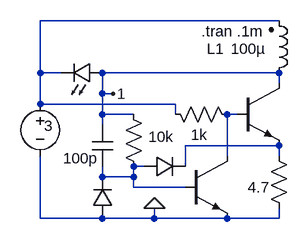
[diagram p0: schematic cur-mode-HPLED-12609.asc]
cur-mode-HPLED-12609.asc, the LTspice schematic file:
Version 4
SHEET 1 1624 1340
WIRE 304 -256 -64 -256
WIRE -64 -176 -64 -256
WIRE -32 -176 -64 -176
WIRE 304 -176 32 -176
WIRE 304 -160 304 -176
WIRE 32 -144 32 -176
WIRE 48 -144 32 -144
WIRE -64 -128 -64 -176
WIRE 144 -128 -64 -128
WIRE 32 -112 32 -144
WIRE 80 -112 32 -112
WIRE 144 -112 144 -128
WIRE 240 -112 224 -112
WIRE 32 -96 32 -112
WIRE 304 -64 160 -64
WIRE 224 -48 224 -112
WIRE 304 -48 304 -64
WIRE 96 -32 80 -32
WIRE 160 -32 160 -64
WIRE 32 -16 32 -32
WIRE 80 -16 80 -32
WIRE 80 -16 32 -16
WIRE 80 0 80 -16
WIRE 160 0 80 0
WIRE -64 48 -64 -48
WIRE 32 48 -64 48
WIRE 112 48 112 32
WIRE 112 48 32 48
WIRE 224 48 112 48
WIRE 304 48 304 32
WIRE 304 48 224 48
FLAG 112 32 0
FLAG 48 -144 1
SYMBOL ind2 288 -160 M180
WINDOW 0 -95 53 Left 0
WINDOW 3 -58 53 Left 0
SYMATTR InstName L1
SYMATTR Value 100µ
SYMBOL npn2 240 -160 R0
WINDOW 0 56 32 Invisible 0
WINDOW 3 56 68 Invisible 0
SYMATTR InstName Q7
SYMATTR Value 2N3904
SYMBOL voltage -64 -144 R0
WINDOW 3 13 65 Bottom 0
WINDOW 123 -32 56 VBottom 0
WINDOW 0 -7 59 Invisible 0
SYMATTR Value 3
SYMATTR InstName V1
SYMATTR SpiceLine Rser=.01
SYMBOL res 96 -16 R180
WINDOW 0 36 76 Invisible 0
WINDOW 3 -46 62 Left 0
SYMATTR InstName R14
SYMATTR Value 10k
SYMBOL diode 16 48 M180
WINDOW 0 24 72 Invisible 0
WINDOW 3 24 0 Invisible 0
SYMATTR InstName D11
SYMATTR Value 1N4148
SYMBOL npn2 160 -48 R0
WINDOW 0 56 32 Invisible 0
WINDOW 3 56 68 Invisible 0
SYMATTR InstName Q2
SYMATTR Value 2N3904
SYMBOL res 320 48 R180
WINDOW 0 36 76 Invisible 0
WINDOW 3 30 48 Left 0
SYMATTR InstName R1
SYMATTR Value 4.7
SYMBOL cap 16 -96 R0
WINDOW 0 -56 78 Invisible 0
WINDOW 3 -18 36 Top 0
SYMATTR InstName C2
SYMATTR Value 100p
SYMBOL res 240 -96 M270
WINDOW 0 32 56 Invisible 0
WINDOW 3 0 59 VBottom 0
SYMATTR InstName R5
SYMATTR Value 1k
SYMBOL diode 96 -48 M90
WINDOW 0 0 32 Invisible 0
WINDOW 3 32 32 Invisible 0
SYMATTR InstName D1
SYMATTR Value 1N4148
SYMATTR Description Schottky diode
SYMATTR Type schottky
SYMBOL LED 32 -160 M270
WINDOW 0 72 32 Invisible 0
WINDOW 3 0 32 Invisible 0
SYMATTR InstName D6
SYMATTR Value LXK2-PW14
SYMATTR Description Schottky diode
SYMATTR Type schottky
TEXT 184 -240 Left 0 !.tran .1m

The netlist it stands for:
* cur-mode-HPLED-12609.asc
L1 1 N001 100µ
Q7 1 N002 N003 0 2N3904
V1 N001 0 3 Rser=.01
R14 N004 1 10k
D11 0 N004 1N4148
Q2 N002 N004 0 0 2N3904
R1 0 N003 4.7
C2 1 N004 100p
R5 N002 N001 1k
D1 N004 N003 1N4148
D6 1 N001 LXK2-PW14
.model D D
.lib standard.dio
.model NPN NPN
.model PNP PNP
.lib standard.bjt
.tran .1m
.backanno
.end